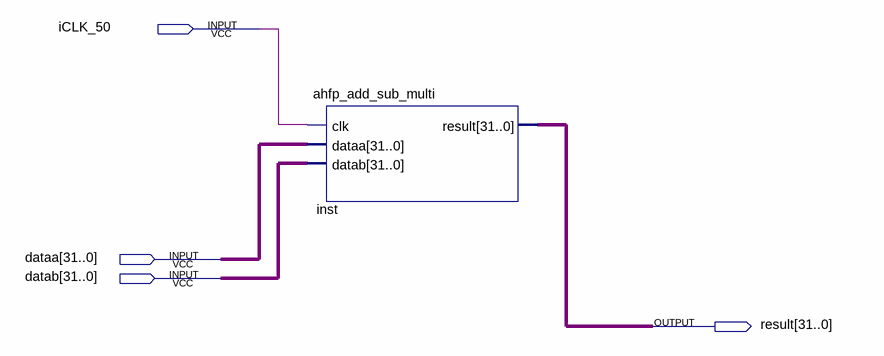
[diagram p0: schematic sheet]
// Quartus schematic design_test_top.bdf as structural Verilog: 1 symbols, 4 pins
module design_test_top (
  input  iCLK_50,
  input  [31:0] dataa,
  input  [31:0] datab,
  output [31:0] result
);

  ahfp_add_sub_multi inst (.clk(iCLK_50), .dataa(dataa), .datab(datab), .result(result));
endmodule
